# EAGLE design Codeshelf-0012.v01 (EAGLE 6.5.0)
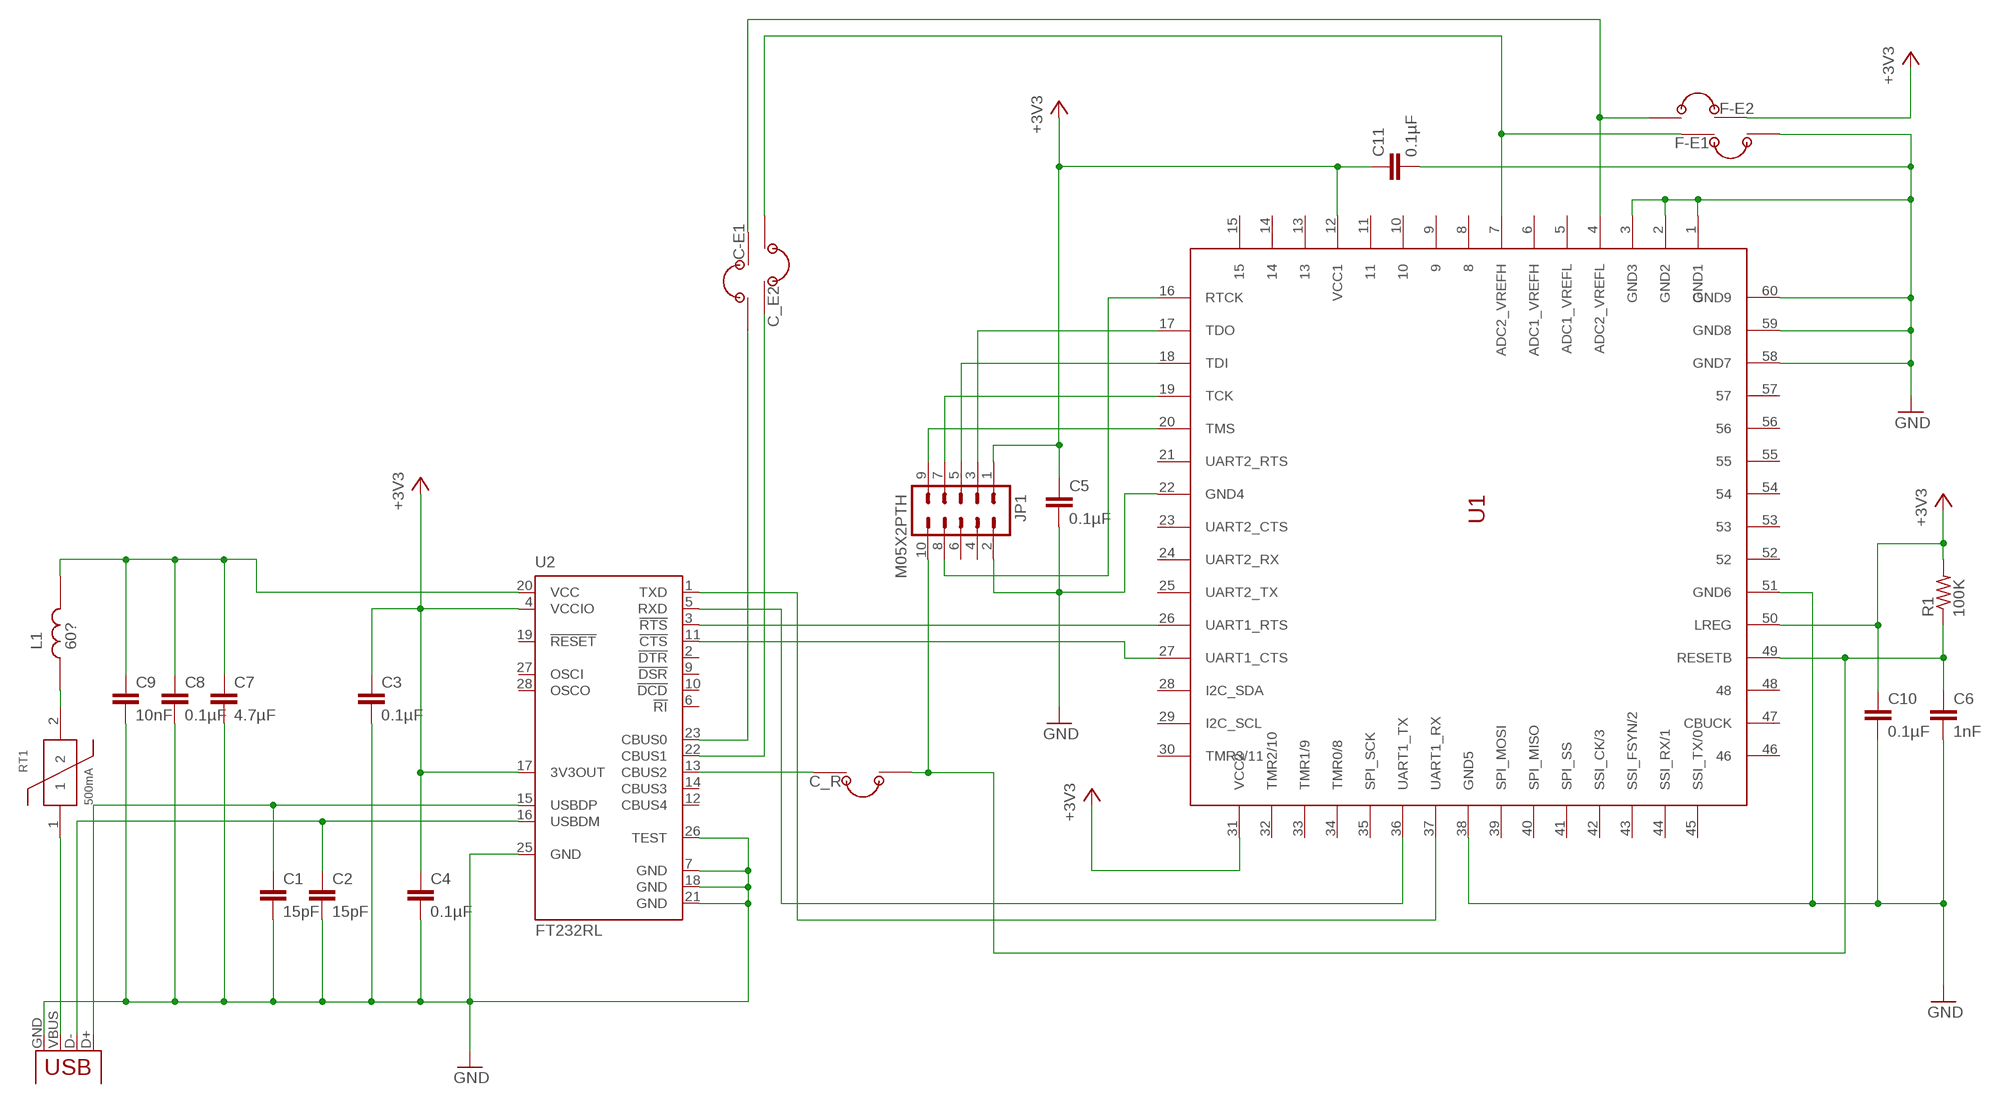
[diagram p0: schematic, sheet 1]

## Parts
C1  15pF  RF-C0402  [C0402]
C2  15pF  RF-C0402  [C0402]
C3  0.1µF  RF-C0402  [C0402]
C4  0.1µF  RF-C0402  [C0402]
C5  0.1µF  RF-C0402  [C0402]
C6  1nF  RF-C0402  [C0402]
C7  4.7µF  RF-C0805  [C0805]
C8  0.1µF  RF-C0402  [C0402]
C9  10nF  RF-C0402  [C0402]
C10  0.1µF  RF-C0402  [C0402]
C11  0.1µF  RF-C0402  [C0402]
C-E1  JUMPER-2X-SMT-VIA  [JUMPER-VIA-2X]
C_E2  JUMPER-2X-SMT-VIA  [JUMPER-VIA-2X]
C_R  JUMPER-2X-SMT-VIA  [JUMPER-VIA-2X]
F-E1  JUMPER-2X-SMT-VIA  [JUMPER-VIA-2X]
F-E2  JUMPER-2X-SMT-VIA  [JUMPER-VIA-2X]
JP1  M05X2PTH  [AVR_ICSP]
L1  60?  RF-L0603  [RF-L0603]
R1  100K  RF-R0402  [RF-R0402]
RT1  500mA  SMD050F  [C1210]
U1  ZSFM201-1A  [ZSFM201-1]
U2  FT232RL  [SSOP28]
X1  USBPTH  [USB-B-PTH]

## Nets
+3V3: C3.1 C4.1 C5.1 C10.1 C11.1 F-E2.2 JP1.1 R1.2 U1.12(VCC1) U1.31(VCC2) U1.50(LREG) U2.4(VCCIO) U2.17(3V3OUT)
GND [GND]: C1.2 C2.2 C3.2 C4.2 C5.2 C6.2 C7.2 C8.2 C9.2 C10.2 C11.2 F-E1.1 JP1.2 U1.1(GND1) U1.2(GND2) U1.3(GND3) U1.22(GND4) U1.38(GND5) U1.51(GND6) U1.58(GND7) U1.59(GND8) U1.60(GND9) U2.7(GND) U2.18(GND) U2.21(GND) U2.25(GND) U2.26(TEST) X1.GND
MCU_CTS: U1.27(UART1_CTS) U2.11(!CTS)
MCU_RTS: U1.26(UART1_RTS) U2.3(!RTS)
MCU_RX: U1.37(UART1_RX) U2.1(TXD)
MCU_TX: U1.36(UART1_TX) U2.5(RXD)
N$9: C-E1.2 F-E2.1 U1.4(ADC2_VREFL)
N$10: C_E2.1 F-E1.2 U1.7(ADC2_VREFH)
N$11: C-E1.1 U2.23(CBUS0)
N$12: C_E2.2 U2.22(CBUS1)
N$19: C_R.2 U2.13(CBUS2)
RESET: C6.1 C_R.1 JP1.10 R1.1 U1.49(RESETB)
RTCK: JP1.8 U1.16(RTCK)
TCK: JP1.7 U1.19(TCK)
TDI: JP1.5 U1.18(TDI)
TDO: JP1.3 U1.17(TDO)
TMS: JP1.9 U1.20(TMS)
USB+: C1.1 U2.15(USBDP) X1.D+
USB-: C2.1 U2.16(USBDM) X1.D-
USB_VCC_1 [USB_VCC]: RT1.1 X1.VBUS
USB_VCC_2 [USB_VCC]: L1.2 RT1.2
USB_VCC_3 [USB_VCC]: C7.1 C8.1 C9.1 L1.1 U2.20(VCC)
Unconnected: JP1.4 JP1.6 U1.5(ADC1_VREFL) U1.6(ADC1_VREFH) U1.8 U1.9 U1.10 U1.11 U1.13 U1.14 U1.15 U1.21(UART2_RTS) U1.23(UART2_CTS) U1.24(UART2_RX) U1.25(UART2_TX) U1.28(I2C_SDA) U1.29(I2C_SCL) U1.30(TMR3/11) U1.32(TMR2/10) U1.33(TMR1/9) U1.34(TMR0/8) U1.35(SPI_SCK) U1.39(SPI_MOSI) U1.40(SPI_MISO) U1.41(SPI_SS) U1.42(SSI_CK/3) U1.43(SSI_FSYN/2) U1.44(SSI_RX/1) U1.45(SSI_TX/0) U1.46 U1.47(CBUCK) U1.48 U1.52 U1.53 U1.54 U1.55 U1.56 U1.57 U2.2(!DTR) U2.6(!RI) U2.9(!DSR) U2.10(!DCD) U2.12(CBUS4) U2.14(CBUS3) U2.19(!RESET) U2.27(OSCI) U2.28(OSCO)

## Library data of the parts
C1 C2 = GW-devices:RF-C: RF capacitor pads for FSL reference design; MFGN: Murata; MFGP: GJM1555C1H150JB01D
C3-C5 C8 C10 C11 = GW-devices:RF-C: RF capacitor pads for FSL reference design; MFGN: Murata; MFGP: GRM155R61A104KA01D
C6 = GW-devices:RF-C: RF capacitor pads for FSL reference design; MFGN: Murata; MFGP: GRM155R71C102KA01D
C7 = GW-devices:RF-C: RF capacitor pads for FSL reference design; MFGN: Murata; MFGP: GRM219R61A475KE34J
C9 = GW-devices:RF-C: RF capacitor pads for FSL reference design; MFGN: Murata; MFGP: GRM155R71E103KA01D
C-E1 C_E2 C_R F-E1 F-E2 = GW-devices:JUMPER-2X: This kind of jumper provides a place to place to put "green wires" for jumpering fetaure/options.
JP1 = SparkFun:M05X2: Header 5x2 Standard 10-pin dual row 0.1" header. Commonly used with AVR-ISP. Use with Spark Fun Electronics SKU: PRT-00778; MFGN: Tyco; MFGP: 9-103324-0
L1 = GW-devices:RF-L: RF inductor pads for FSL reference design; MFGN: Murata; MFGP: BLM18PG600SN1D
R1 = GW-devices:RF-R: RF resistor pads for FSL reference design; MFGN: Pansonic; MFGP: ERJ-2GEJ104X; PRICE: 0.10
RT1 = GW-devices:SMD050F: Tyco current limit switch; MFGN: Tyco; MFGP: MICROSMD050F-2
U1 = GW-devices:ZSFM201-1: The CEL MC13224V; MFGN: CEL; MFGP: ZFSM-201-1
U2 = ftdichip:FT232R: Source: http://www.ftdichip.com/Documents/DataSheets/DS_FT232R_v104.pdf; MFGN: FTDI; MFGP: FT232RL; MPN: FT232RL; OC_FARNELL: 1146032; OC_NEWARK: 91K9918
X1 = SparkFun:USB: USB Connectors USB-B-PTH is fully proven SKU : PRT-00139 USB-miniB is fully proven SKU : PRT-00587 USB-A-PCB is untested. USB-A-H is throughly reviewed, but untested. Spark Fun Electronics SKU : PRT-00437 USB-B-SMT is throughly reviewed, but untested. Needs silkscreen touching up. USB-A-S has not been used/tested USB-MB-H has not been used/tested; MFGN: Tyco; MFGP: 292304-1

## Net classes
1 USB_VCC: width 0.4 mm
2 GND: width 0.3 mm

## Board
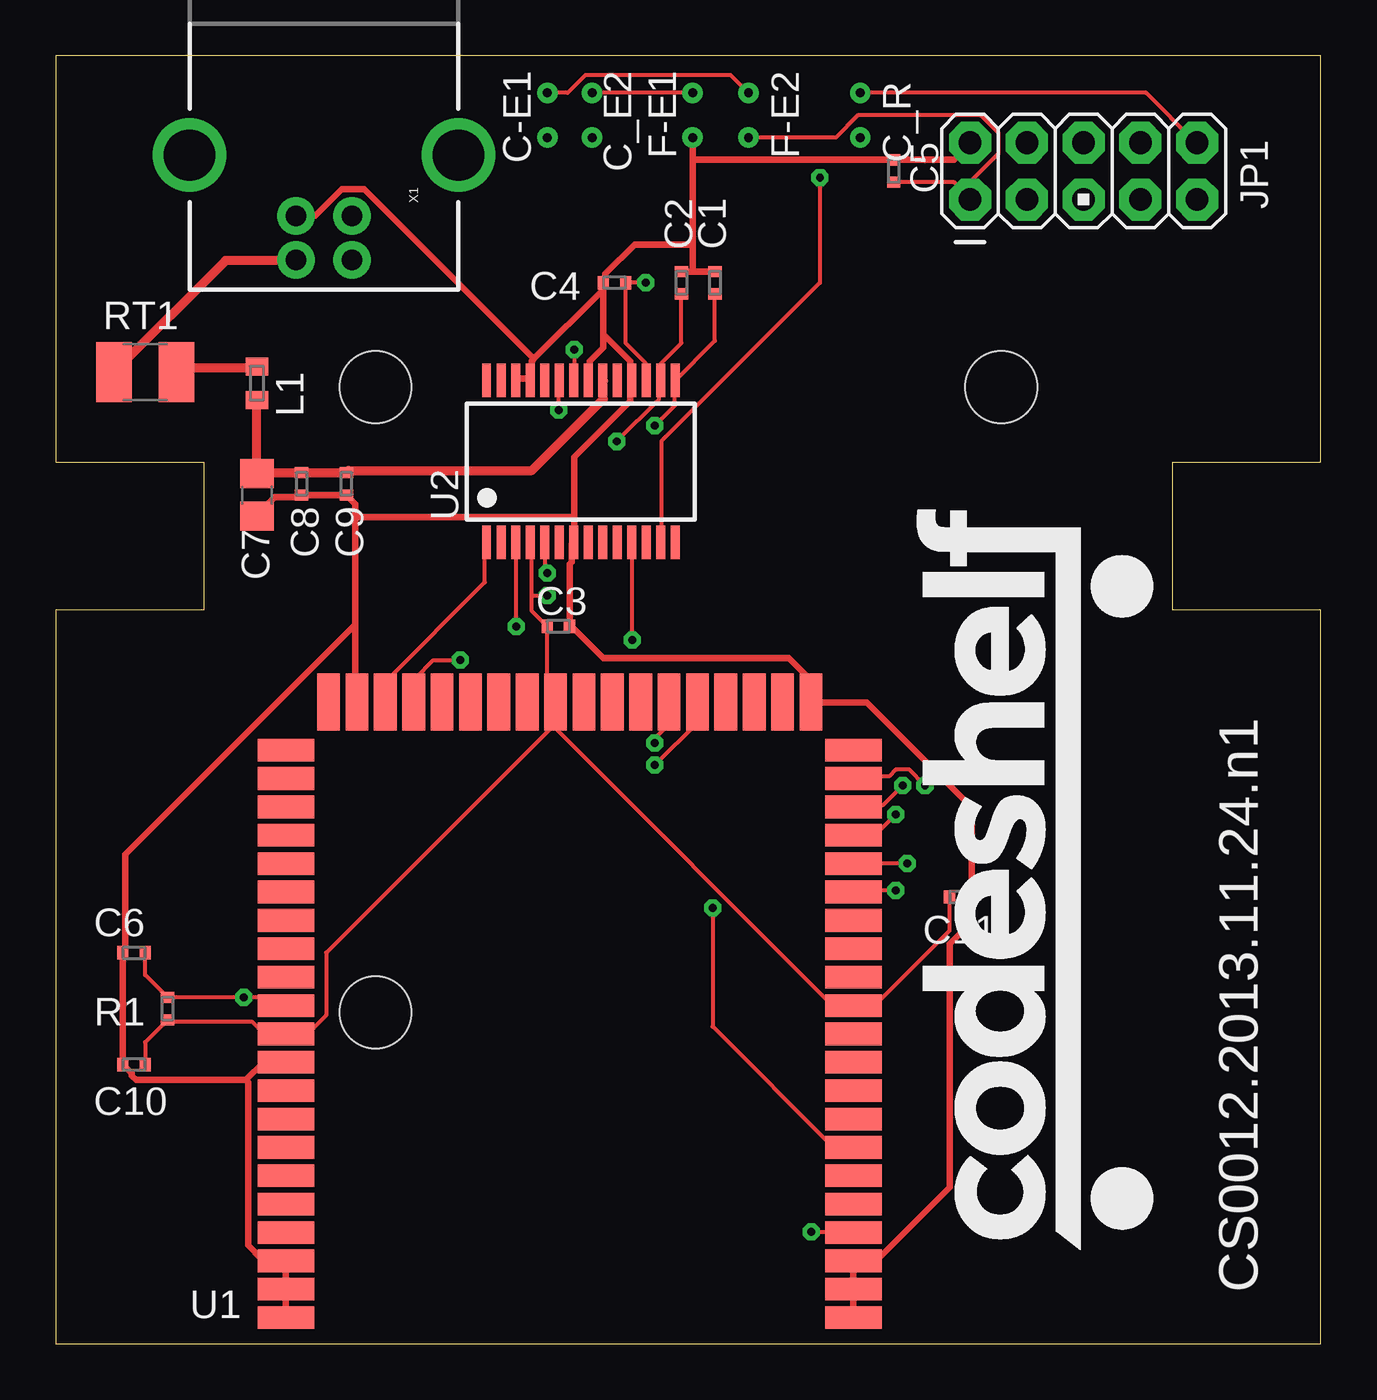
[diagram p1: board, top side]
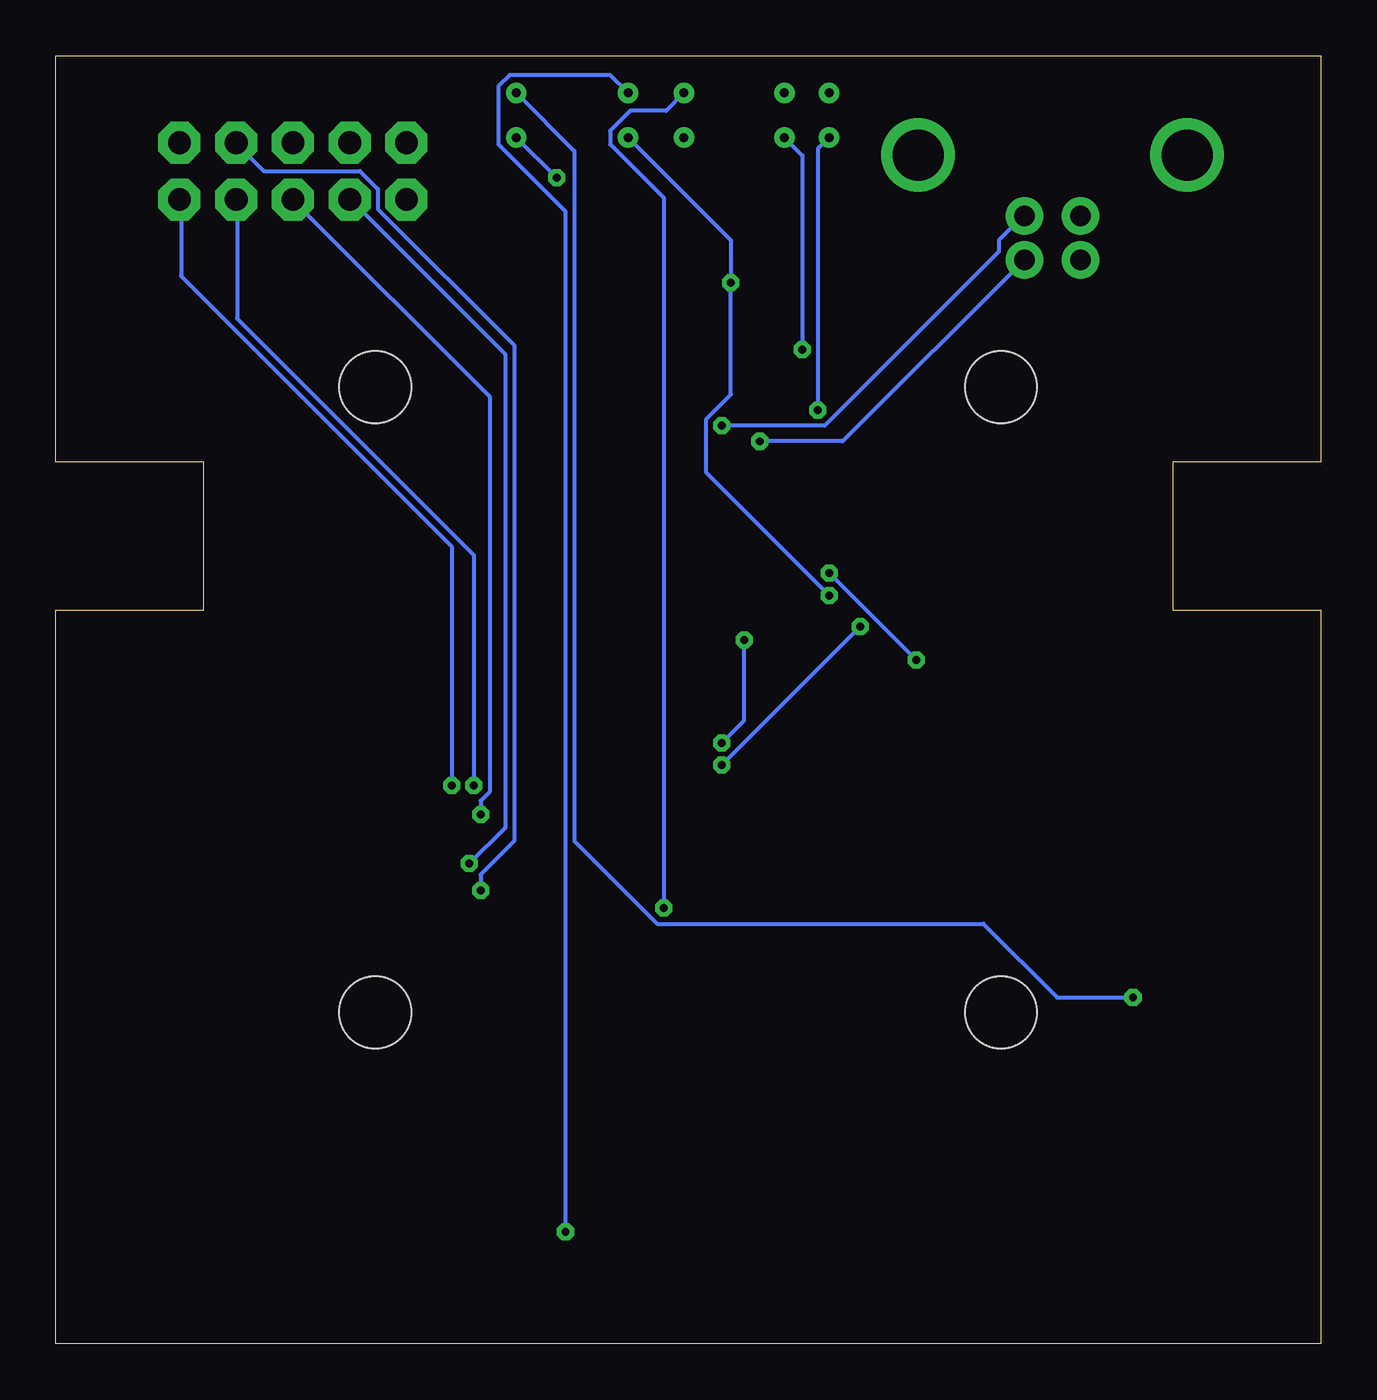
[diagram p2: board, bottom side, seen from below]

Size 56.61 x 57.66 mm. Coordinates in mm from the lower left corner, seen from the top.
Outline: 0,0 56.61,0 56.61,32.85 49.99,32.85 49.99,39.48 56.61,39.48 56.61,57.66 0,57.66 0,39.48 6.62,39.48 6.62,32.85 0,32.85 0,0
Copper layers (1*16): Top 0.0356mm / dielectric 1.5011mm / Bottom 0.0356mm
Design rules "SilverCircuits": minimum track width 7mil, minimum drill 14mil, track to track 7mil, track to pad 7mil, pad to pad 7mil, via to via 7mil, smd to smd 0mil, copper to edge 20mil, drill to drill 8mil, minimum pad ring 10mil, minimum via ring 8mil, stop-mask expansion 4mil, vias tented up to drill 0mil, thermal gap 10mil
Holes 3.2 mm at 14.31,14.83 14.31,42.83 42.31,42.83 42.31,14.83

### Footprints (pad centres in the part's own frame; a part is rotated, then mirrored left to right if it is on the bottom)
C0402 = smd 0.5 x 0.6: 1 -0.5,0; 2 0.5,0
C0805 = smd 1.3 x 1.5: 1 -0.95,0; 2 0.95,0
JUMPER-VIA-2X = drill 0.4: 1 -1,0; 2 1,0
AVR_ICSP = drill 1.016 pad 1.88 octagon: 1 -1.27,5.08; 2 1.27,5.08; 3 -1.27,2.54; 4 1.27,2.54; 5 -1.27,0; 6 1.27,0; 7 -1.27,-2.54; 8 1.27,-2.54; 9 -1.27,-5.08; 10 1.27,-5.08
RF-L0603 = smd 0.8 x 1: 1 -0.75,0; 2 0.75,0
RF-R0402 = smd 0.5 x 0.6: 1 -0.5,0; 2 0.5,0
C1210 = smd 1.6 x 2.7: 1 -1.4,0; 2 1.4,0
ZSFM201-1 = smd 2.54 x 1.016: 1 -12.7,28.829; 2 -12.7,27.559; 3 -12.7,26.289; 4 -12.7,25.019; 5 -12.7,23.749; 6 -12.7,22.479; 7 -12.7,21.209; 8 -12.7,19.939; 9 -12.7,18.669; 10 -12.7,17.399; 11 -12.7,16.129; 12 -12.7,14.859; 13 -12.7,13.589; 14 -12.7,12.319; 15 -12.7,11.049; 16 -12.7,9.779; 17 -12.7,8.509; 18 -12.7,7.239; 19 -12.7,5.969; 20 -12.7,4.699; 21 -12.7,3.429; 40 12.7,3.429; 41 12.7,4.699; 42 12.7,5.969; 43 12.7,7.239; 44 12.7,8.509; 45 12.7,9.779; 46 12.7,11.049; 47 12.7,12.319; 48 12.7,13.589; 49 12.7,14.859; 50 12.7,16.129; 51 12.7,17.399; 52 12.7,18.669; 53 12.7,19.939; 54 12.7,21.209; 55 12.7,22.479; 56 12.7,23.749; 57 12.7,25.019; 58 12.7,26.289; 59 12.7,27.559; 60 12.7,28.829 | smd 1.016 x 2.54: 22 -10.795,1.27; 23 -9.525,1.27; 24 -8.255,1.27; 25 -6.985,1.27; 26 -5.715,1.27; 27 -4.445,1.27; 28 -3.175,1.27; 29 -1.905,1.27; 30 -0.635,1.27; 31 0.635,1.27; 32 1.905,1.27; 33 3.175,1.27; 34 4.445,1.27; 35 5.715,1.27; 36 6.985,1.27; 37 8.255,1.27; 38 9.525,1.27; 39 10.795,1.27
SSOP28 = smd 0.4 x 1.5: 1 -4.225,-3.625; 2 -3.575,-3.625; 3 -2.925,-3.625; 4 -2.275,-3.625; 5 -1.625,-3.625; 6 -0.975,-3.625; 7 -0.325,-3.625; 8 0.325,-3.625; 9 0.975,-3.625; 10 1.625,-3.625; 11 2.275,-3.625; 12 2.925,-3.625; 13 3.575,-3.625; 14 4.225,-3.625; 15 4.225,3.625; 16 3.575,3.625; 17 2.925,3.625; 18 2.275,3.625; 19 1.625,3.625; 20 0.975,3.625; 21 0.325,3.625; 22 -0.325,3.625; 23 -0.975,3.625; 24 -1.625,3.625; 25 -2.275,3.625; 26 -2.925,3.625; 27 -3.575,3.625; 28 -4.225,3.625
USB-B-PTH = drill 0.914 pad 1.676: D+ 0,1.25; D- 1.981,1.25; GND 0,-1.25; VBUS 1.981,-1.25 | drill 2.286: P$1 -2.718,-6.02; P$2 -2.718,6.02

### Placement (x,y rotation side)
C1  29.5,47.5 90 top
C2  28,47.5 90 top
C3  22.49,32.12 0 top
C4  25,47.5 180 top
C5  37.5,52.5 90 top
C6  3.5,17.5 180 top
C7  9,38 270 top
C8  11,38.5 270 top
C9  13,38.5 270 top
C10  3.5,12.5 180 top
C11  40.5,20 0 top
C-E1  22,55 90 top
C_E2  24,55 270 top
C_R  36,55 270 top
F-E1  28.5,55 90 top
F-E2  31,55 270 top
JP1  46,52.5 90 top
L1  9,43 90 top
R1  5,15 270 top
RT1  4,43.5 0 top
U1  23,30 180 top
U2  23.5,39.5 0 top
U$1  [CODESHELF-LOGO]  49.1,4.2 90 top
X1  12,50.5 270 top

### Tracks (layer width: path | path; a pad name or v marks a point on that pad's centre or on a via)
+3V3  (via drill 0.36)
  Top 0.178: U2.17 26.4,43.2 26.4,43.9 25.5,44.8 C4.1 v26.4,47.5 | C5.1 40.2,52 40.9,51.3 JP1.1 40.6,51.7 42.2,53.3 42.2,54.2 41.4,55 35.9,55 34.9,54 F-E2.2 | C11.1 40,18.5 36.7,15.2 35.7,15.2 | C10.1 4,13.5 R1.2 5,14.4 8.8,14.4 9.3,13.9 10.3,13.9 | U1.31 22.3,28.8 22,29.1 22,32.1 C3.1 21.9,32.2 21.3,32.8 21.3,33.5 | 21.3,33.5 21.3,35.8 U2.4 | 10.3,13.9 11.3,13.9 12.1,14.7 12.1,17.5 22.3,27.7 22.3,28.7 U1.31 | 10.3,13.9 U1.50 | 35.7,15.2 34.7,15.2 22.3,27.6 U1.31 | 35.7,15.2 U1.12 | 21.3,33.5 v22,33.5
  Bottom 0.178: F-E2.2 26.4,49.4 v26.4,47.5 26.4,42.5 27.5,41.4 27.5,39 v22,33.5
GND
  Top 0.3: U1.1 U1.2 U1.3 35.8,3.8 36.8,3.8 40,7 40,17.9 40.9,18.8 40.9,19.9 C11.2 41,24 36.3,28.7 33.8,28.7 U1.22 33.7,28.8 33.7,29.8 32.8,30.7 24.5,30.7 23.1,32.1 C3.2 23,32.2 23,34.9 23.1,35 23.1,35.8 U2.7 23.2,36 23.2,37 | U1.60 U1.59 U1.58 10.2,3.8 9.2,3.8 8.6,4.4 8.6,11.7 8.5,11.8 | 8.5,11.8 3.6,11.8 3.4,12 3.4,12.1 C10.2 C6.2 3.1,17.6 3.1,21.9 13.3,32.1 13.4,32.1 | 8.5,11.8 9.3,12.6 U1.51 | C7.2 9,37.1 9.8,37.9 10.9,37.9 C8.2 C9.2 13.4,37.6 13.4,37 | 13.4,37 13.4,32.1 | 13.4,32.1 13.4,28.8 U1.38 | JP1.2 40.9,53.7 40.2,53 C5.2 28.5,53 | C1.2 28.5,48 | 28.5,48 C2.2 | F-E1.1 28.5,53 | 28.5,53 28.5,49.2 | 28.5,49.2 28.5,48 | U2.26 20.6,43.2 21.2,43.2 U2.25 21.3,43.3 21.3,44 21.4,44.1 | 24.5,45.1 24.5,44.6 23.9,44 23.9,43.2 U2.21 | 24.5,45.1 24.5,47.1 | 24.5,47.1 C4.2 24.6,47.6 24.6,47.9 25.9,49.2 28.5,49.2 | 24.5,45.1 24.6,45.1 25.7,44 25.7,43.2 U2.18 25.7,43 25.7,42.2 23.2,39.7 23.2,37 | 21.4,44.1 24.4,47.1 24.5,47.1 | X1.GND 11.6,50.5 12.8,51.7 13.8,51.7 21.4,44.1 | 23.2,37 13.4,37
MCU_CTS  (via drill 0.36)
  Top 0.178: v25.8,31.5 25.8,35.8 U2.11 | v26.8,26.9 26.8,27.1 27.4,27.7 27.4,28.7 U1.27
  Bottom 0.178: v25.8,31.5 25.8,27.9 v26.8,26.9
MCU_RTS  (via drill 0.36)
  Top 0.178: v20.6,32.1 20.6,35.8 U2.3 | v26.8,25.9 28.7,27.8 28.7,28.7 U1.26
  Bottom 0.178: v26.8,25.9 v20.6,32.1
MCU_RX
  Top 0.178: U2.1 19.2,35.8 19.2,34.1 14.8,29.7 14.8,28.8 U1.37
MCU_TX  (via drill 0.36)
  Top 0.178: v22,34.5 21.9,34.6 21.9,35.8 U2.5 | v18.1,30.6 16.9,30.6 16.1,29.8 16.1,28.8 U1.36
  Bottom 0.178: v18.1,30.6 v22,34.5
N$9  (via drill 0.36)
  Top 0.178: C-E1.2 22.9,56 23.7,56.8 30.2,56.8 F-E2.1 | v33.8,5 35.7,5 U1.4
  Bottom 0.178: v33.8,5 33.8,50.7 36.8,53.7 36.8,56.3 36.3,56.8 31.8,56.8 F-E2.1
N$10  (via drill 0.36)
  Top 0.178: F-E1.2 C_E2.1 | v29.4,19.5 29.4,14.2 34.8,8.8 U1.7
  Bottom 0.178: v29.4,19.5 29.4,51.3 31.8,53.7 31.8,54.3 30.9,55.2 29.3,55.2 F-E1.2
N$11  (via drill 0.36)
  Top 0.178: v22.5,41.8 22.5,43.1 U2.23
  Bottom 0.178: v22.5,41.8 22.5,53.5 C-E1.1
N$12  (via drill 0.36)
  Top 0.178: v23.2,44.5 23.2,43.2 U2.22
  Bottom 0.178: v23.2,44.5 23.2,53.2 C_E2.2
N$19  (via drill 0.36)
  Top 0.178: v34.2,52.2 34.2,47.5 27.1,40.4 27.1,35.9 U2.13
  Bottom 0.178: C_R.2 v34.2,52.2
RESET  (via drill 0.36)
  Top 0.178: C6.1 4,16.5 R1.1 v8.4,15.5 10,15.5 10.3,15.2 U1.49 | C_R.1 48.8,56 51,53.8 JP1.10
  Bottom 0.178: v8.4,15.5 11.8,15.5 15.1,18.8 29.7,18.8 33.4,22.5 33.4,53.4 C_R.1
RTCK  (via drill 0.36)
  Top 0.178: v37.6,20.3 35.7,20.3 U1.16
  Bottom 0.178: v37.6,20.3 37.6,21 36.1,22.5 36.1,44.7 42.2,50.8 42.2,51.7 43,52.5 47.3,52.5 48.5,53.7 JP1.8
TCK  (via drill 0.36)
  Top 0.178: v37.9,25 37,24.1 35.7,24.1 U1.19
  Bottom 0.178: v37.9,25 37.9,35.3 48.5,45.9 48.5,51.2 JP1.7
TDI  (via drill 0.36)
  Top 0.178: v37.6,23.7 36.7,22.8 35.7,22.8 U1.18
  Bottom 0.178: v37.6,23.7 37.6,24.3 37.2,24.7 37.2,42.4 46,51.2 JP1.5
TDO  (via drill 0.36)
  Top 0.178: v38.1,21.5 U1.17
  Bottom 0.178: v38.1,21.5 36.5,23.1 36.5,44.3 43.4,51.2 JP1.3
TMS  (via drill 0.36)
  Top 0.178: v38.9,25 38.2,25.7 37.6,25.7 37.3,25.4 35.7,25.4 U1.20
  Bottom 0.178: v38.9,25 38.9,35.7 51,47.8 51,51.2 JP1.9
USB+  (via drill 0.36)
  Top 0.178: C1.1 29.5,44.9 U2.15 27.7,43.1 27.7,42 v26.8,41.1
  Bottom 0.178: v26.8,41.1 22.2,41.1 14.4,48.9 14.4,49.4 13.3,50.5 X1.D+
USB-  (via drill 0.36)
  Top 0.178: C2.1 28,44.8 27.1,43.9 27.1,43.2 U2.16 27,43.1 27,42.3 v25.1,40.4
  Bottom 0.178: v25.1,40.4 21.4,40.4 13.3,48.5 X1.D-
USB_VCC_1
  Top 0.4: RT1.1 7.6,48.5 10.7,48.5 X1.VBUS
USB_VCC_2
  Top 0.4: RT1.2 5.6,43.7 9,43.7 L1.2
USB_VCC_3
  Top 0.4: L1.1 C7.1 9,39 C8.1 C9.1 13.1,39.1 21.3,39.1 24.5,42.3 24.5,43.1 U2.20

### Text on the board
tNames: CS0012.2013.11.24.n1